# Altium schematic sheet CPCIS_PWR_MOD_DC.SchDoc
size 420 x 297 mm
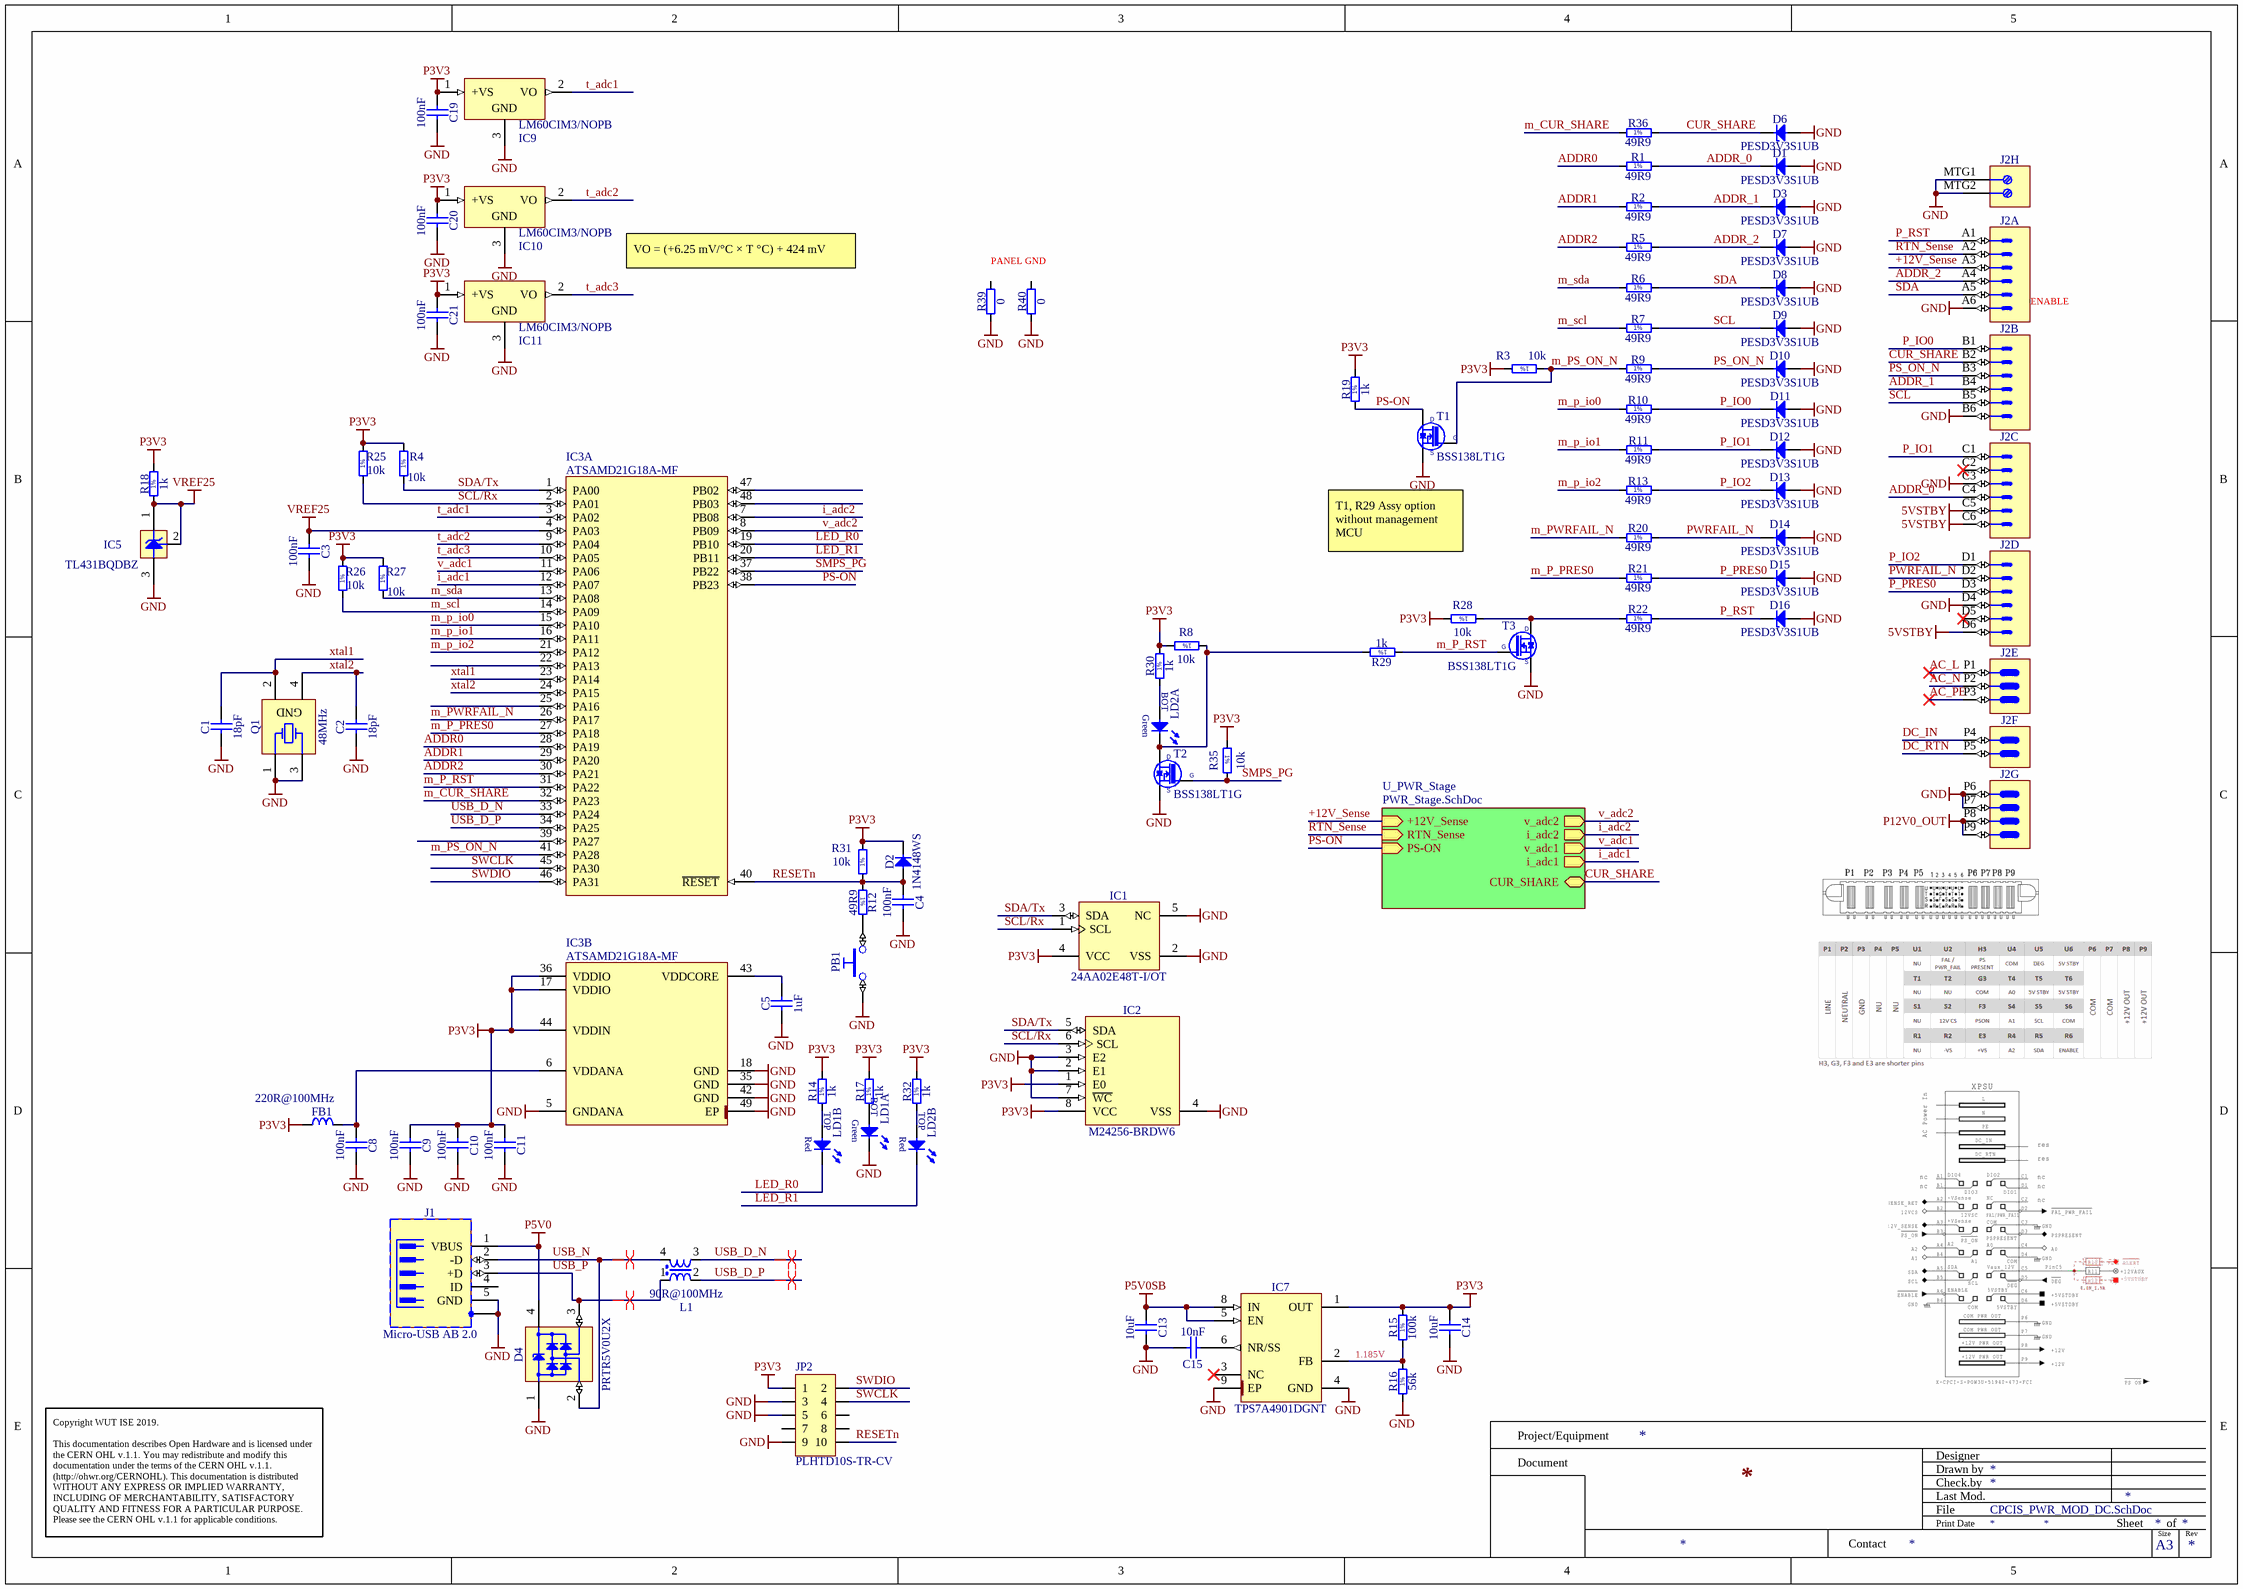
[diagram p0: CPCIS_PWR_MOD_DC.SchDoc]

## Parts
C1  18pF  [CAPC1005X55N]
C2  18pF  [CAPC1005X55N]
C3  100nF  [CAPC1005X55N]
C4  100nF  [CAPC1005X55N]
C5  1uF  [CAPC1608X87N]
C8  100nF  [CAPC1005X55N]
C9  100nF  [CAPC1005X55N]
C10  100nF  [CAPC1005X55N]
C11  100nF  [CAPC1005X55N]
C13  10uF  [CAPC2012X135N]
C14  10uF  [CAPC2012X135N]
C15  10nF  [CAPC1005X55N]
C19  100nF  [CAPC1005X55N]
C20  100nF  [CAPC1005X55N]
C21  100nF  [CAPC1005X55N]
D1  PESD3V3S1UB  [SODFL1608X65N]
D2  1N4148WS  [SODFL2512X100N]
D3  PESD3V3S1UB  [SODFL1608X65N]
D4  PRTR5V0U2X  [SOT190P230X110-4N]
D6  PESD3V3S1UB  [SODFL1608X65N]
D7  PESD3V3S1UB  [SODFL1608X65N]
D8  PESD3V3S1UB  [SODFL1608X65N]
D9  PESD3V3S1UB  [SODFL1608X65N]
D10  PESD3V3S1UB  [SODFL1608X65N]
D11  PESD3V3S1UB  [SODFL1608X65N]
D12  PESD3V3S1UB  [SODFL1608X65N]
D13  PESD3V3S1UB  [SODFL1608X65N]
D14  PESD3V3S1UB  [SODFL1608X65N]
D15  PESD3V3S1UB  [SODFL1608X65N]
D16  PESD3V3S1UB  [SODFL1608X65N]
FB1  220R@100MHz  [INDC2012X105N]
IC1  24AA02E48T-I/OT  [SOT95P280X145-5N]
IC2  M24256-BRDW6  [SOP65P640X120-8N]
IC3  ATSAMD21G18A-MF  [QFN50P700X700X100-49N-S525]  (parts A,B of 2)
IC5  TL431BQDBZ  [SOT95P250X110-3N]
IC7  TPS7A4901DGNT  [SOP65P490X110-9N-R157X189]
IC9  LM60CIM3/NOPB  [DBZ0003A_M]
IC10  LM60CIM3/NOPB  [DBZ0003A_M]
IC11  LM60CIM3/NOPB  [DBZ0003A_M]
J1  Micro-USB AB 2.0  [HIROSE_ZX62RD-AB-5P8(30)]
J2  PwrBlade  [AMPHENOL_51939-667]  (value not drawn)  (parts A,B,C,D,E,F,G,H of 8)
JP2  PLHTD10S-TR-CV  [PLHTD10S-TR-CV]
L1  90R@100MHz  [IND_MURATA_DLW21S]
LD1  Red/Green  [LED_DIALIGHT_571-0112F]  (value not drawn)  (parts A,B of 2)
LD2  Red/Green  [LED_DIALIGHT_571-0112F]  (value not drawn)  (parts A,B of 2)
PB1  Push Button  [PB_TYCO_FSMSM]  (value not drawn)
Q1  48MHz  [XTAL_TXC_7M]
R1  49R9  [RESC1005X40N]
R2  49R9  [RESC1005X40N]
R3  10k  [RESC1005X40N]
R4  10k  [RESC1005X40N]
R5  49R9  [RESC1005X40N]
R6  49R9  [RESC1005X40N]
R7  49R9  [RESC1005X40N]
R8  10k  [RESC1005X40N]
R9  49R9  [RESC1005X40N]
R10  49R9  [RESC1005X40N]
R11  49R9  [RESC1005X40N]
R12  49R9  [RESC1005X40N]
R13  49R9  [RESC1005X40N]
R14  1k  [RESC1005X40N]
R15  100k  [RESC1005X40N]
R16  56k  [RESC1005X40N]
R17  1k  [RESC1005X40N]
R18  1k  [RESC1005X40N]
R19  1k  [RESC1005X40N]
R20  49R9  [RESC1005X40N]
R21  49R9  [RESC1005X40N]
R22  49R9  [RESC1005X40N]
R25  10k  [RESC1005X40N]
R26  10k  [RESC1005X40N]
R27  10k  [RESC1005X40N]
R28  10k  [RESC1005X40N]
R29  1k  [RESC1005X40N]
R30  1k  [RESC1005X40N]
R31  10k  [RESC1005X40N]
R32  1k  [RESC1005X40N]
R35  10k  [RESC1005X40N]
R36  49R9  [RESC1005X40N]
R39  0  [RESC1608X55N]
R40  0  [RESC1608X55N]
T1  BSS138LT1G  [SOT95P240X110-3N]
T2  BSS138LT1G  [SOT95P240X110-3N]
T3  BSS138LT1G  [SOT95P240X110-3N]

## Sub-sheets
U_PWR_Stage = PWR_Stage.SchDoc: v_adc2 (out), i_adc2 (out), +12V_Sense (in), RTN_Sense (in), v_adc1 (out), i_adc1 (out), PS-ON (in), CUR_SHARE (bidir)

## Nets
5VSTBY: J2.C5 J2.C6 J2.D6
GND: C1.1 C2.1 C3.2 C4.2 C5.1 C8.2 C9.2 C10.2 C11.2 C13.2 C14.2 C15.2 C19.2 C20.2 C21.2 D1.2(A) D3.2(A) D4.1(GND) D6.2(A) D7.2(A) D8.2(A) D9.2(A) D10.2(A) D11.2(A) D12.2(A) D13.2(A) D14.2(A) D15.2(A) D16.2(A) IC1.2(VSS) IC1.5(NC) IC2.2(E1) IC2.3(E2) IC2.4(VSS) IC2.7(~{WC}) IC3.5(GNDANA) IC3.18(GND) IC3.35(GND) IC3.42(GND) IC3.49(EP) IC5.3(A) IC7.4(GND) IC7.9(EP) IC9.3(GND) IC10.3(GND) IC11.3(GND) J1.5(GND) J1.6(SH) J2.A6 J2.B6 J2.C3 J2.D4 J2.MTG1 J2.MTG2 J2.P6 J2.P7 JP2.3 JP2.5 JP2.9 LD1.1(C) PB1.1 Q1.1(X) Q1.3(X) R16.1 R39.1 R40.1 T1.2(S) T2.2(S) T3.2(S)
P3V3: C9.1 C10.1 C11.1 C14.1 C19.1 C20.1 C21.1 D2.1(C) FB1.1 IC1.4(VCC) IC2.1(E0) IC2.8(VCC) IC3.17(VDDIO) IC3.36(VDDIO) IC3.44(VDDIN) IC7.1(OUT) IC9.1(+VS) IC10.1(+VS) IC11.1(+VS) JP2.1 R3.2 R4.2 R8.2 R14.2 R15.2 R17.2 R18.2 R19.2 R25.2 R26.2 R27.2 R28.2 R30.2 R31.2 R32.2 R35.1
P5V0: D4.4(VCC) J1.1(VBUS)
P5V0SB: C13.1 IC7.5(EN) IC7.8(IN)
P12V0_OUT: J2.P8 J2.P9
VREF25: C3.1 IC3.4(PA03) IC5.1(C) IC5.2(Adj) R18.1
+12V_Sense: J2.A3 ; sheet U_PWR_Stage/+12V_Sense
AC_L: J2.P1
AC_N: J2.P2
AC_PE: J2.P3
ADDR0: IC3.28(PA19) R1.1
ADDR1: IC3.29(PA20) R2.1
ADDR2: IC3.30(PA21) R5.1
ADDR_0: D1.1(C) J2.C4 R1.2
ADDR_1: D3.1(C) J2.B4 R2.2
ADDR_2: D7.1(C) J2.A4 R5.2
CUR_SHARE: D6.1(C) J2.B2 R36.2 ; sheet U_PWR_Stage/CUR_SHARE
DC_IN: J2.P4
DC_RTN: J2.P5
i_adc1: IC3.12(PA07) ; sheet U_PWR_Stage/i_adc1
i_adc2: IC3.7(PB08) ; sheet U_PWR_Stage/i_adc2
LED_R0: IC3.19(PB10) LD1.3(C)
LED_R1: IC3.20(PB11) LD2.3(C)
m_CUR_SHARE: IC3.32(PA23) R36.1
m_p_io0: IC3.15(PA10) R10.1
m_p_io1: IC3.16(PA11) R11.1
m_p_io2: IC3.21(PA12) R13.1
m_P_PRES0: IC3.27(PA18) R21.1
m_P_RST: IC3.31(PA22) R29.1 T3.1(G)
m_PS_ON_N: IC3.41(PA28) R3.1 R9.1 T1.1(G)
m_PWRFAIL_N: IC3.26(PA17) R20.1
m_scl: IC3.14(PA09) R7.1 R26.1
m_sda: IC3.13(PA08) R6.1 R27.1
P_IO0: D11.1(C) J2.B1 R10.2
P_IO1: D12.1(C) J2.C1 R11.2
P_IO2: D13.1(C) J2.D1 R13.2
P_PRES0: D15.1(C) J2.D3 R21.2
P_RST: D16.1(C) J2.A1 R22.2
PS-ON: IC3.38(PB23) R19.1 T1.3(D) ; sheet U_PWR_Stage/PS-ON
PS_ON_N: D10.1(C) J2.B3 R9.2
PWRFAIL_N: D14.1(C) J2.D2 R20.2
RESETn: C4.1 D2.2(A) IC3.40(~{RESET}) JP2.10 R12.1 R31.1
RTN_Sense: J2.A2 ; sheet U_PWR_Stage/RTN_Sense
SCL: D9.1(C) J2.B5 R7.2
SCL/Rx: IC1.1(SCL) IC2.6(SCL) IC3.2(PA01) R25.1
SDA: D8.1(C) J2.A5 R6.2
SDA/Tx: IC1.3(SDA) IC2.5(SDA) IC3.1(PA00) R4.1
SMPS_PG: IC3.37(PB22) R35.2 T2.1(G)
SWCLK: IC3.45(PA30) JP2.4
SWDIO: IC3.46(PA31) JP2.2
t_adc1: IC3.3(PA02) IC9.2(VO)
t_adc2: IC3.9(PA04) IC10.2(VO)
t_adc3: IC3.10(PA05) IC11.2(VO)
USB_D_N: IC3.33(PA24) L1.3
USB_D_P: IC3.34(PA25) L1.2
USB_N: D4.2(I/O1) J1.2(-D) L1.4
USB_P: D4.3(I/O2) J1.3(+D) L1.1
v_adc1: IC3.11(PA06) ; sheet U_PWR_Stage/v_adc1
v_adc2: IC3.8(PB09) ; sheet U_PWR_Stage/v_adc2
xtal1: C1.2 IC3.23(PA14) Q1.2(GND)
xtal2: C2.2 IC3.24(PA15) Q1.4(GND)
NetC5_2: C5.2 IC3.43(VDDCORE)
NetC8_1: C8.1 FB1.2 IC3.6(VDDANA)
NetC15_1: C15.1 IC7.6(NR/SS)
NetIC7_2: IC7.2(FB) R15.1 R16.2
NetLD1_2: LD1.2(A) R17.1
NetLD1_4: LD1.4(A) R14.1
NetLD2_1: LD2.1(C) R8.1 R29.2 T2.3(D)
NetLD2_2: LD2.2(A) R30.1
NetLD2_4: LD2.4(A) R32.1
NetPB1_2: PB1.2 R12.2
NetR22_1: R22.1 R28.1 T3.3(D)

Not connected (* = marked no-connect by the designer): IC3 22(PA13) 25(PA16) 39(PA27) 47(PB02) 48(PB03); IC7 3(NC)*; J1 4(ID); J2 C2* D5*; JP2 6 7 8; R39 2; R40 2

## Layout directives
differential pair; differential pair class 90_Ohm: USB_D_N, USB_D_P, USB_N, USB_P

## Notes on the sheet
- VO = (+6.25 mV/°C × T °C) + 424 mV
- PANEL GND
- (near J2) ENABLE
- T1, R29 Assy option without management MCU
- 1.185V
- Project/Equipment
- Document
- Designer
- Drawn by
- Check.by
- Copyright WUT ISE 2019.
  This documentation describes Open Hardware and is licensed under the CERN OHL v.1.1. You may redistribute and modify this documentation under the terms of the CERN OHL v.1.1. (http://ohwr.org/CERNOHL). This documentation is distributed WITHOUT ANY EXPRESS OR IMPLIED WARRANTY, INCLUDING OF MERCHANTABILITY, SATISFACTORY QUALITY AND FITNESS FOR A PARTICULAR PURPOSE. Please see the CERN OHL v.1.1 for applicable conditions.
- Contact
- File
- Last Mod.
- Print Date
- Sheet
- Size
- A3
- of
- Rev
- (in symbol LED_DIALIGHT_571-0112F, part A) BOT; Green
- (in symbol LED_DIALIGHT_571-0112F, part B) TOP; Red
- (in symbol R0402_1K_1%_0.0625W_100PPM) 1%
- (in symbol R0402_10K_1%_0.0625W_100PPM) 1%
- (in symbol R0402_49R9_1%_0.0625W_100PPM) 1%
- (in symbol R0402_56K_1%_0.0625W_100PPM) 1%
- (in symbol R0402_100K_1%_0.0625W_100PPM) 1%

## Library data of the parts
C1 C2 = CC0402_18PF_50V_5%_C0G: Non-polarised capacitor; Part Description: SMD Multilayer Chip Ceramic Capacitor; Manufacturer: GENERIC; Manufacturer1 Part Number: C0402C180J5GACTU; Voltage: 50V; TC: C0G/NP0; Tolerance: ±5%; Part Number: CC0402_18PF_50V_5%_C0G; Component Kind: Standard; Component Type: Standard; Pin Count: 2; Value: 18pF; Status: Preferred; Manufacturer Part Number: CC0402_18PF_50V_5%_C0G; Case: 0402; Mounted: Yes; Socket: No; SMD: Yes; Sense: No; Manufacturer1 Example: KEMET; Manufacturer1 ComponentHeight: 0.55mm; HelpURL: \\cern.ch\dfs\Applications\Altium\Datasheets\CC0805_C0G_KEMET_(Commercial Grade).pdf; Author: CERN DEM JLC; CreateDate: 04.10.2016; LatestRevisionDate: 04.10.2016
C3 C4 C8-C11 C19-C21 = CC0402_100NF_16V_10%_X7R: Non-polarised capacitor; Part Description: SMD Multilayer Chip Ceramic Capacitor; Manufacturer: GENERIC; Manufacturer1 Part Number: GRM155R71C104KA88D; Voltage: 16V; TC: X7R; Tolerance: ±10%; Part Number: CC0402_100NF_16V_10%_X7R; Component Kind: Standard; Component Type: Standard; Pin Count: 2; Value: 100nF; Status: Not Recommended; Manufacturer Part Number: CC0402_100NF_16V_10%_X7R; Case: 0402; Mounted: Yes; Socket: No; SMD: Yes; Manufacturer1 Example: MURATA; Manufacturer1 ComponentHeight: 0.55mm; HelpURL: \\cern.ch\dfs\Applications\Altium\Datasheets\CC0402_X7R_MURATA_GRM.pdf; Author: CERN DEM JLC; CreateDate: 05.12.2013; LatestRevisionDate: 03.12.2007; Sense: No
C5 = CC0603_1UF_16V_10%_X7R: Non-polarised capacitor; Part Description: SMD Multilayer Chip Ceramic Capacitor; Manufacturer: GENERIC; Manufacturer1 Part Number: 223878615663; Voltage: 16V; TC: X7R; Tolerance: ±10%; Part Number: CC0603_1UF_16V_10%_X7R; Component Kind: Standard; Component Type: Standard; Pin Count: 2; Value: 1uF; Status: None; Manufacturer Part Number: CC0603_1uF_16V_10%_X7R; Case: 0603; Mounted: Yes; Socket: No; SMD: Yes; Sense: No; Manufacturer1 Example: YAGEO PHYCOMP; Manufacturer1 ComponentHeight: 0.9mm; HelpURL: \\cern.ch\dfs\Applications\Altium\Datasheets\CC0603_X7R_PHYCOMP.pdf; Author: CERN DEM JLC; CreateDate: 03.12.2007; LatestRevisionDate: 17.04.2015
C13 C14 = CC0805_10UF_16V_10%_X5R: Non-polarised capacitor; Part Description: SMD Multilayer Chip Ceramic Capacitor; Manufacturer: GENERIC; Manufacturer1 Part Number: C0805C106K4PAC; Voltage: 16V; TC: X5R; Tolerance: ±10%; Part Number: CC0805_10UF_16V_10%_X5R; Component Kind: Standard; Component Type: Standard; Pin Count: 2; Value: 10uF; Status: Preferred; Manufacturer Part Number: CC0805_10UF_16V_10%_X5R; Case: 0805; Mounted: Yes; Socket: No; SMD: Yes; Manufacturer1 Example: KEMET; Manufacturer1 ComponentHeight: 1.4mm; HelpURL: \\cern.ch\dfs\Applications\Altium\Datasheets\CC1206_X5R_KEMET.pdf; Author: CERN DEM JLC; CreateDate: 03.12.2007; LatestRevisionDate: 03.12.2007; Sense: No
C15 = CC0402_10NF_50V_10%_X7R: Non-polarised capacitor; Part Description: SMD Multilayer Chip Ceramic Capacitor; Manufacturer: GENERIC; Manufacturer1 Part Number: GRM155R71H103KA88D; Voltage: 50V; TC: X7R; Tolerance: ±10%; Part Number: CC0402_10NF_50V_10%_X7R; Component Kind: Standard; Component Type: Standard; Pin Count: 2; Value: 10nF; Status: None; Manufacturer Part Number: CC0402_10NF_50V_10%_X7R; Case: 0402; Mounted: Yes; Socket: No; SMD: Yes; Sense: No; Manufacturer1 Example: MURATA; Manufacturer1 ComponentHeight: 0.55mm; HelpURL: \\cern.ch\dfs\Applications\Altium\Datasheets\CC0402_X7R_MURATA_GRM.pdf; Author: CERN DEM MR; CreateDate: 08/01/2016; LatestRevisionDate: 08/01/2016
D1 D3 D6-D16 = PESD3V3S1UB: ESD protection diode; Part Description: ESD protection diode (23kV); Manufacturer: NXP SEMICONDUCTORS; Voltage: 3V3; Power: 330W; PressFit: No; Bonding: No; Part Number: PESD3V3S1UB; Component Kind: Standard; Component Type: Standard; Device: PESD3V3S1UB; PackageDescription: Ultra Small Outline Diode Flat Lead (SOD-523), Body; 1.2mm L X 0.8mm W X 0.65mm H, IPC Medium Density; Manufacturer Part Number: PESD3V3S1UB; Pin Count: 2; Case: SOD523; Mounted: Yes; Socket: No; SMD: Yes; Sense: No; ComponentHeight: 0.65mm; HelpURL: \\cern.ch\dfs\Applications\Altium\Datasheets\PESD3V3S1UB.pdf; Author: CERN DEM JLC; CreateDate: 29.11.2012; LatestRevisionDate: 29.11.2012
D2 = 1N4148WS: Diode; Part Description: Small Signal Diodes; Manufacturer: FAIRCHILD SEMICONDUCTOR; Voltage: 75V; Power: 150mA; PressFit: No; Bonding: No; Part Number: 1N4148WS; Component Kind: Standard; Component Type: Standard; Device: 1N4148WS; PackageDescription: SODFL Diode; 1.70mm W X 1.25mm L X 1.00mm H body, IPC Medium Density; Manufacturer Part Number: 1N4148WS; Pin Count: 2; Case: SOD-323F; Mounted: Yes; Socket: No; SMD: Yes; Sense: No; ComponentHeight: 1mm; HelpURL: \\cern.ch\dfs\Applications\Altium\Datasheets\1N4148WS.pdf; Author: CERN DEM JLC; CreateDate: 12.05.2011; LatestRevisionDate: 12.05.2011
D4 = PRTR5V0U2X: Ultra Low Capacitance Double Rail-to-Rail ESD Protection Diode; Part Description: Ultra Low Capacitance (1pF) Double Rail-to-Rail ESD Protection Diode (8kV); Manufacturer: NXP SEMICONDUCTORS; Voltage: 5.5V; PressFit: No; Bonding: No; Table: Diodes; Part Number: PRTR5V0U2X; Component Kind: Standard; Component Type: Standard; Device: PRTR5V0U2X; PackageDescription: SOT143B, SOT, 1.90mm Pitch; 4 Pin, 1.30mm W X 2.90mm L X 1.10mm H body, IPC Medium Density; Manufacturer Part Number: PRTR5V0U2X; Pin Count: 4; Case: SOT143B; Mounted: Yes; Socket: No; SMD: Yes; ComponentHeight: 1.1mm; HelpURL: \\cern.ch\dfs\Applications\Altium\Datasheets\PRTR5V0U2X.pdf; Author: CERN DEM JLC; CreateDate: 2011-03-22; LatestRevisionDate: 2011-03-22
FB1 = IND0805_MURATA_BLM21PG221SN1D: Inductor; Part Description: SMD EMIFIL Suppression Chip Ferrite Bead; Manufacturer: MURATA; Power: 2A; Resistance: 0.05R; Tolerance: ±25%; Table: Inductors SMD; Part Number: IND0805_MURATA_BLM21PG221SN1D; Component Kind: Standard; Component Type: Standard; Pin Count: 2; Value: 220R@100MHz; Status: None; Manufacturer Part Number: BLM21PG221SN1D; Case: 0805; Mounted: Yes; Socket: No; SMD: Yes; ComponentHeight: 1.05mm; HelpURL: \\cern.ch\dfs\Applications\Altium\Datasheets\IND0402_MURATA_BLM21P.pdf; Author: CERN DEM JLC; CreateDate: 2010-01-25; LatestRevisionDate: 2010-01-25
IC1 = 24AA02E48T-I/OT: 1.7V-5.5V, 2K I2C Serial EEPROM With EUI-48 Node Identity; Manufacturer: MICROCHIP TECHNOLOGY; PressFit: No; Bonding: No; Part Number: 24AA02E48T-I/OT; Component Kind: Standard; Component Type: Standard; Device: 24AA02E48T-I/OT; PackageDescription: SOT, 0.95mm pitch; 5 pin, 1.60mm W X 2.90mm L X 1.45mm H body, IPC Medium Density; Part Description: 1.7V-5.5V, 2K I2C Serial EEPROM With EUI-48 Node Identity; Manufacturer Part Number: 24AA02E48T-I/OT; Pin Count: 5; Case: SOT23-5; Mounted: Yes; Socket: No; SMD: Yes; Sense: No; ComponentHeight: 1.45mm; HelpURL: \\cern.ch\dfs\Applications\Altium\Datasheets\24AA02E48T-I-OT.pdf; Author: CERN DEM MR; CreateDate: 31.03.2016; LatestRevisionDate: 31.03.2016
IC2 = MEM_M24256-BRDW6P: 256-Kbit Serial I²C Bus EEPROM; Manufacturer: ST MICROELECTRONICS; PressFit: No; Bonding: No; Part Number: M24256-BRDW6P; Component Kind: Standard; Component Type: Standard; Device: M24256-BRDW6; PackageDescription: SOP, 0.65mm pitch; 8 pin, 4.40mm W X 3.00mm L X 1.20mm H body, IPC Medium Density; Part Description: 256-Kbit Serial I²C Bus EEPROM; Manufacturer Part Number: M24256-BRDW6; Pin Count: 8; Case: TSSOP8; Mounted: Yes; Socket: No; SMD: Yes; Sense: No; ComponentHeight: 1.2mm; HelpURL: \\cern.ch\dfs\Applications\Altium\Datasheets\M24256-BRDW6P.pdf; Author: CERN DEM MR; CreateDate: 17.03.2016; LatestRevisionDate: 17.03.2016
IC3 = ATSAMD21G18A-MF: 32-bit ARM®-based Cortex®-M0+ core Microcontroller, 1.62V to 3.6V, 48MHz, 256KB Flash, 32KB of SRAM, 48 QFN, Industrial Grade (-40°C to 125°C); Part Description: 32-bit ARM®-based Cortex®-M0+ core Microcontroller, 1.62V to 3.6V, 48MHz, 256KB Flash, 32KB SRAM, 48 QFN, Temperature Range -40°C to 125°C; Manufacturer: MICROCHIP; PressFit: No; Bonding: No; Part Number: ATSAMD21G18A-MF; Component Kind: Standard; Component Type: Standard; Device: ATSAMD21G18A-MF; PackageDescription: QFN, 0.50mm Pitch, Square; 48 Pin, 7.00mm L X 7.00mm W X 1mm H Body (W/Thermal Tab 5.25mm X 5.25mm), IPC Medium Density; Manufacturer Part Number: ATSAMD21G18A-MF; Pin Count: 49; Case: QFN48; Mounted: Yes; Socket: No; SMD: Yes; Sense: No; ComponentHeight: 1mm; HelpURL: \\cern.ch\dfs\Applications\Altium\Datasheets\ATSAMD21G18A-MF.pdf; Author: CERN DEM BC; CreateDate: 23.01.2018; LatestRevisionDate: 23.01.2018
IC5 = TL431BQDBZ: Precision Reference 1=Cathode 2=Adj 3=Anode; Part Description: Vref (2.495V) To 36V 0.5% Precision Programmable Reference; Manufacturer: NXP SEMICONDUCTORS; PressFit: No; Bonding: No; Part Number: TL431BQDBZ; Component Kind: Standard; Component Type: Standard; Device: TL431BQDBZ; PackageDescription: SOT23, 0.95mm Pitch; 3 Pin, 1.3mm W X 2.9mm L X 1.1mm H Body, IPC Medium Density; Manufacturer Part Number: TL431BQDBZ; Pin Count: 3; Case: SOT23; Mounted: Yes; Socket: No; SMD: Yes; Sense: No; ComponentHeight: 1.1mm; HelpURL: \\cern.ch\dfs\Applications\Altium\Datasheets\TL431BQDBZ.pdf; Author: CERN DEM MR; CreateDate: 18.04.2016; LatestRevisionDate: 18.04.2016
IC7 = TPS7A4901DGNT: +36V, +150mA, Ultralow-Noise, Positive Linear Regulator; Manufacturer: TEXAS INSTRUMENTS; PressFit: No; Bonding: No; Part Number: TPS7A4901DGNT; Component Kind: Standard; Component Type: Standard; Device: TPS7A4901DGNT; PackageDescription: SOP,0.65mm,pitch; 8 pin,3.00mm W X 3.00mm L X 1.10mm H body (w/thermal tab 1.57 X 1.89 mm), IPC Medium Density; Part Description: +36V, +150mA, Ultralow-Noise, Positive Linear Regulator; Manufacturer Part Number: TPS7A4901DGNT; Pin Count: 9; Case: TSSOP8; Mounted: Yes; Socket: No; SMD: Yes; Sense: No; ComponentHeight: 1.1mm; HelpURL: \\cern.ch\dfs\Applications\Altium\Datasheets\TPS7A4901DGNT.pdf; Author: CERN DEM JLC; CreateDate: 08.03.2011; LatestRevisionDate: 08.03.2011
IC9-IC11 = CMP-0066-00231-3: 2.7V Temperature Sensor, 3-pin SOT-23, Pb-Free; Manufacturer: Texas Instruments; PackageTopMarking: T6C*XTT; PowerWise: N; CompType: Temp Sensor IC; PackageDescription: Molded SOT-23, .115 x .051 x .037in Body, 3 Lead, .075 in Pitch; ComponentLink1URL: http://www.ti.com/general/docs/lit/getliterature.tsp?genericPartNumber=LM60&fileType=pdf; PackageReference: DBZ0003A; PinCount: 3; ComponentLink1Description: Datasheet URL; RoHS: Y
J1 = HIROSE_ZX62RD-AB-5P8(30): 5 Pin + 1 Shield USB Receptacle; Part Description: Micro-USB 2.0 Right Angle, SMD Type AB - Reverse (Top mount), Shell Through Hole; Manufacturer: HIROSE (HRS); PressFit: No; Part Number: HIROSE_ZX62RD-AB-5P8(30); Component Kind: Standard; Component Type: Standard; Pin Count: 7; Family: Micro-USB AB 2.0; Mounted: Yes; Socket: No; SMD: Yes; Sense: No; Status: None; Manufacturer Part Number: ZX62RD-AB-5P8(30); ComponentHeight: 2.35mm; HelpURL: \\cern.ch\dfs\Applications\Altium\Datasheets\HIROSE_ZX62RD-AB-5P8(30).pdf; ComponentLink1URL: \\cern.ch\dfs\Applications\Altium\Datasheets\HIROSE_ZX62RD-AB-5P8(30)_Package-Drawing.pdf; ComponentLink1Description: Package-Drawing; Author: CERN DEM JMW; CreateDate: 22.06.2017; LatestRevisionDate: 22.06.2017
J2 = AMPHENOL_51939-667: Thru-Hole, Lead 3.43mm, PowerBlade Right Angled Power Connector 3ACP 2P 24S 4P Contacts; Part Description: Right Angle PowerBlade Power Connector 3ACP + 2P + 24S + 4P Contacts; PressFit: No; Part Number: AMPHENOL_51939-667; Component Kind: Standard; Component Type: Standard; Pin Count: 33; Family: PwrBlade; Mounted: Yes; Socket: No; SMD: No; Sense: No; Status: None; Manufacturer: AMPHENOL; Manufacturer Part Number: 51939-667; ComponentHeight: 12.57mm; HelpURL: \\cern.ch\dfs\Applications\Altium\Datasheets\AMPHENOL_51939-667.pdf; Author: CERN DEM JLC; CreateDate: 05.03.2019; LatestRevisionDate: 05.03.2019
JP2 = CON_2x5 1.27 SMT Male: 1.27 mm dual row goldpin (Maritex)
L1 = IND_MURATA_DLW21SN900SQ2L: Inductor Common Mode; Part Description: Wire Wound Common Mode Choke Coil (DLW21S Series); Manufacturer: MURATA; Power: 330mA; Resistance: 0.35R; Tolerance: ±25%; Table: Inductors SMD; Part Number: IND_MURATA_DLW21SN900SQ2L; Component Kind: Standard; Component Type: Standard; Pin Count: 4; Value: 90R@100MHz; Status: None; Manufacturer Part Number: DLW21SN900SQ2L; Case: 0805; Mounted: Yes; Socket: No; SMD: Yes; ComponentHeight: 1.4mm; HelpURL: \\cern.ch\dfs\Applications\Altium\Datasheets\IND_MURATA_DLW21S.pdf; Author: CERN DEM JLC; CreateDate: 2014-07-01; LatestRevisionDate: 2014-07-01
LD1 LD2 = LED_DIALIGHT_571-0112F: 2x LED  Botom Green, Top Red; Part Description: Dual 2mm  LEDs, Red Top,Green Bot, CBI® Circuit Board Indicator (Without positioning pins); PressFit: No; Bonding: No; Part Number: LED_DIALIGHT_571-0112F; Component Kind: Standard; Component Type: Standard; Color: Red/Green; PackageDescription: 2x 2mm LED (Top: Red, Bot: Green) PCB Edge Mounting (Without positioning pins) DIALIGHT 571 Serie; Manufacturer: DIALIGHT; Manufacturer Part Number: 571-0112F; Pin Count: 4; Mounted: Yes; Socket: No; SMD: No; Sense: No; ComponentHeight: 8.6mm; HelpURL: \\cern.ch\dfs\Applications\Altium\Datasheets\LED_DIALIGHT_571-0112F.pdf; Author: CERN DEM JLC; CreateDate: 09.11.2009; LatestRevisionDate: 17.03.2010
PB1 = PB_TYCO_FSMSM: Push-Button Switch SPDT; Part Description: 12VDC 50mA SPST Tactile  Push-Button Switch; Manufacturer: TYCO ELECTRONICS; Manufacturer Part Number: FSMSM or 1437566-3; PressFit: No; Part Number: PB_TYCO_FSMSM; Component Kind: Standard; Component Type: Standard; Pin Count: 2; PackageDescription: Body 3.5x6.0mm, Pushbutton Switch,  TYCO ALCOSWITCH FSMSM Serie; Family: Push Button; Mounted: Yes; Socket: No; SMD: Yes; Sense: No; Status: None; ComponentHeight: 4.3mm; HelpURL: \\cern.ch\dfs\Applications\Altium\Datasheets\PB_TYCO_FSMSM.pdf; Author: CERN DEM JLC; CreateDate: 30.06.2008; LatestRevisionDate: 21.06.2012
Q1 = XTAL_48MHZ_TXC_7M-48.000MAHV: Crystal 4 pins 1=XTAL Control 2=GND3=XTAL 4=GND; Part Description: ±30ppm 8pF -40°C to +85°C  4 Pins, 3.2x2.5X0.8mm, SMD Sealing Crystal, 7M Series; Manufacturer: TXC CORPORATION; PressFit: No; Bonding: No; Part Number: XTAL_48MHZ_TXC_7M-48.000MAHV; Component Kind: Standard; Component Type: Standard; PackageDescription: 4 Pins, 2.5x3.2mm, SMD Sealing Crystal, 7M Serie; Value: 48MHz; Manufacturer Part Number: 7M-48.000MAHV; Pin Count: 4; Mounted: Yes; Socket: No; SMD: Yes; Sense: No; ComponentHeight: 0.8mm; HelpURL: \\cern.ch\dfs\Applications\Altium\Datasheets\XTAL_TXC_7M.pdf; Author: CERN DEM MR; CreateDate: 30.05.2016; LatestRevisionDate: 30.05.2016
R1 R2 R5-R7 R9-R13 R20-R22 R36 = R0402_49R9_1%_0.0625W_100PPM: Resistor - 1%; Part Description: General Purpose Thick Film Chip Resistor; Manufacturer: GENERIC; Manufacturer1 Part Number: 232270674999L or RC0402FR-0749R9L; TC: ±100ppm/°C; Table: Resistors SMD; Part Number: R0402_49R9_1%_0.0625W_100PPM; Component Kind: Standard; Component Type: Standard; Pin Count: 2; Value: 49R9; Status: Not recommended; Power: 0.0625W; Tolerance: ±1%; Manufacturer Part Number: R0402_49R9_1%_0.0625W_100PPM; Case: 0402; Mounted: Yes; Socket: No; SMD: Yes; Manufacturer1 Example: YAGEO PHYCOMP; Manufacturer1 ComponentHeight: 0.4mm; HelpURL: \\cern.ch\dfs\Applications\Altium\Datasheets\R0402_Phycomp_RC0402.pdf; Author: CERN DEM JLC; CreateDate: 2012-10-24; LatestRevisionDate: 2012-10-24
R3 R4 R8 R25-R28 R31 R35 = R0402_10K_1%_0.0625W_100PPM: Resistor - 1%; Part Description: General Purpose Thick Film Chip Resistor; Manufacturer: GENERIC; Manufacturer1 Part Number: 232270671003L; TC: ±100ppm/°C; Table: Resistors SMD; Part Number: R0402_10K_1%_0.0625W_100PPM; Component Kind: Standard; Component Type: Standard; Pin Count: 2; Value: 10k; Status: Not recommended; Power: 0.0625W; Tolerance: ±1%; Manufacturer Part Number: R0402_10K_1%_0.0625W_100PPM; Case: 0402; Mounted: Yes; Socket: No; SMD: Yes; Manufacturer1 Example: YAGEO PHYCOMP; Manufacturer1 ComponentHeight: 0.4mm; HelpURL: \\cern.ch\dfs\Applications\Altium\Datasheets\R0402_Phycomp_RC0402.pdf; Author: CERN DEM JLC; CreateDate: 2007-12-03; LatestRevisionDate: 2012-10-17
R14 R17-R19 R29 R30 R32 = R0402_1K_1%_0.0625W_100PPM: Resistor - 1%; Part Description: General Purpose Thick Film Chip Resistor; Manufacturer: GENERIC; Manufacturer1 Part Number: 232270671002L; TC: ±100ppm/°C; PressFit: No; Part Number: R0402_1K_1%_0.0625W_100PPM; Component Kind: Standard; Component Type: Standard; Pin Count: 2; Value: 1k; Status: Not Recommended; Power: 0.0625W; Tolerance: ±1%; Manufacturer Part Number: R0402_1K_1%_0.0625W_100PPM; Case: 0402; Mounted: Yes; Sense: No; Socket: No; SMD: Yes; Manufacturer1 Example: YAGEO PHYCOMP; Manufacturer1 ComponentHeight: 0.4mm; HelpURL: \\cern.ch\dfs\Applications\Altium\Datasheets\R0402_Phycomp_RC0402.pdf; Author: CERN DEM JLC; CreateDate: 03.12.2007; LatestRevisionDate: 17.10.2012
R15 = R0402_100K_1%_0.0625W_100PPM: Resistor - 1%; Part Description: General Purpose Thick Film Chip Resistor; Manufacturer: GENERIC; Manufacturer1 Part Number: 232270671004L; TC: ±100ppm/°C; PressFit: No; Part Number: R0402_100K_1%_0.0625W_100PPM; Component Kind: Standard; Component Type: Standard; Pin Count: 2; Value: 100k; Status: Not Recommended; Power: 0.0625W; Tolerance: ±1%; Manufacturer Part Number: R0402_100K_1%_0.0625W_100PPM; Case: 0402; Mounted: Yes; Sense: No; Socket: No; SMD: Yes; Manufacturer1 Example: YAGEO PHYCOMP; Manufacturer1 ComponentHeight: 0.4mm; HelpURL: \\cern.ch\dfs\Applications\Altium\Datasheets\R0402_Phycomp_RC0402.pdf; Author: CERN DEM JLC; CreateDate: 03.12.2007; LatestRevisionDate: 17.10.2012
R16 = R0402_56K_1%_0.0625W_100PPM: Resistor - 1%; Part Description: General Purpose Thick Film Chip Resistor; Manufacturer: GENERIC; Manufacturer1 Part Number: 232270675603L; TC: ±100ppm/°C; PressFit: No; Part Number: R0402_56K_1%_0.0625W_100PPM; Component Kind: Standard; Component Type: Standard; Pin Count: 2; Value: 56k; Status: Not Recommended; Power: 0.0625W; Tolerance: ±1%; Manufacturer Part Number: R0402_56K_1%_0.0625W_100PPM; Case: 0402; Mounted: Yes; Sense: No; Socket: No; SMD: Yes; Manufacturer1 Example: YAGEO PHYCOMP; Manufacturer1 ComponentHeight: 0.4mm; HelpURL: \\cern.ch\dfs\Applications\Altium\Datasheets\R0402_Phycomp_RC0402.pdf; Author: CERN DEM JLC; CreateDate: 03.12.2007; LatestRevisionDate: 17.10.2012
R39 R40 = R0603_0R_JUMPER: Resistor; Part Description: 1A (0.05R Max DC Resistance) Zero Ohm Jumper; Manufacturer: GENERIC; Manufacturer1 Part Number: NRC06Z0; PressFit: No; Part Number: R0603_0R_JUMPER; Component Kind: Standard; Component Type: Standard; Pin Count: 2; Value: 0; Status: Preferred; Manufacturer Part Number: R0603_0R_JUMPER; Case: 0603; Mounted: Yes; Sense: No; Socket: No; SMD: Yes; Manufacturer1 Example: NIC COMPONENT; Manufacturer1 ComponentHeight: 0.55mm; HelpURL: \\cern.ch\dfs\Applications\Altium\Datasheets\R0603_NIC_NRC.pdf; Author: CERN DEM JLC; CreateDate: 03.12.2007; LatestRevisionDate: 13.03.2008
T1-T3 = BSS138LT1G: N-CHANNEL MOSFET WITH DIODE; Part Description: 50V 200mA N-Channel Enhancement Mode Field-Effect Transistor; Manufacturer: ON SEMICONDUCTOR; PressFit: No; Bonding: No; Part Number: BSS138LT1G; Component Kind: Standard; Component Type: Standard; Device: BSS138LT1G; PackageDescription: SOT23 3-Leads, Pitch 0.95mm - Body 1.4x3mm, IPC Medium Density; Manufacturer Part Number: BSS138LT1G; Pin Count: 3; Case: SOT23-3; Mounted: Yes; Socket: No; SMD: Yes; Sense: No; ComponentHeight: 1.11mm; HelpURL: \\cern.ch\dfs\Applications\Altium\Datasheets\BSS138LT1G.pdf; Author: CERN DEM JLC; CreateDate: 23.03.2009; LatestRevisionDate: 23.03.2009